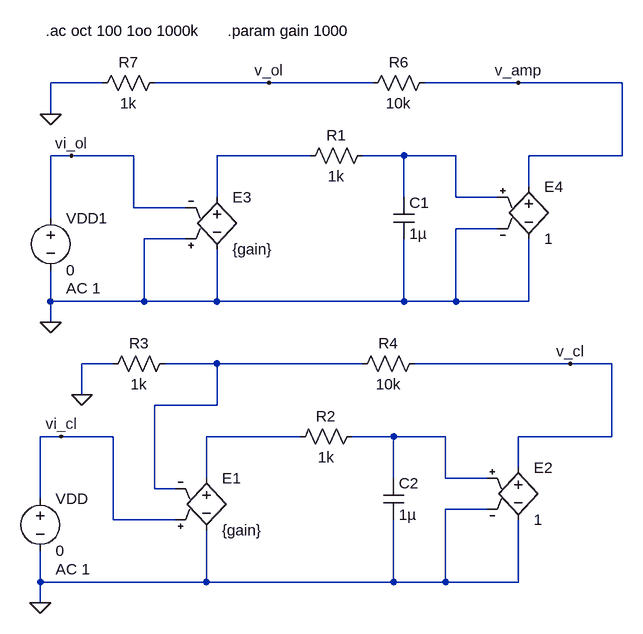
[diagram p0: schematic 1st_order.asc]
1st_order.asc, the LTspice schematic file:
Version 4
SHEET 1 1092 932
WIRE -928 -560 -1008 -560
WIRE -672 -560 -848 -560
WIRE -512 -560 -672 -560
WIRE -288 -560 -432 -560
WIRE -128 -560 -288 -560
WIRE -1008 -512 -1008 -560
WIRE -976 -448 -1008 -448
WIRE -880 -448 -976 -448
WIRE -608 -448 -752 -448
WIRE -464 -448 -528 -448
WIRE -384 -448 -464 -448
WIRE -128 -448 -128 -560
WIRE -128 -448 -272 -448
WIRE -272 -400 -272 -448
WIRE -752 -384 -752 -448
WIRE -464 -384 -464 -448
WIRE -384 -384 -384 -448
WIRE -320 -384 -384 -384
WIRE -880 -368 -880 -448
WIRE -800 -368 -880 -368
WIRE -1008 -352 -1008 -448
WIRE -320 -336 -384 -336
WIRE -800 -320 -864 -320
WIRE -1008 -224 -1008 -272
WIRE -864 -224 -864 -320
WIRE -864 -224 -1008 -224
WIRE -752 -224 -752 -304
WIRE -752 -224 -864 -224
WIRE -464 -224 -464 -320
WIRE -464 -224 -752 -224
WIRE -384 -224 -384 -336
WIRE -384 -224 -464 -224
WIRE -272 -224 -272 -320
WIRE -272 -224 -384 -224
WIRE -1008 -192 -1008 -224
WIRE -912 -128 -960 -128
WIRE -752 -128 -832 -128
WIRE -528 -128 -752 -128
WIRE -208 -128 -448 -128
WIRE -144 -128 -208 -128
WIRE -960 -80 -960 -128
WIRE -752 -64 -752 -128
WIRE -752 -64 -848 -64
WIRE -992 -16 -1024 -16
WIRE -912 -16 -992 -16
WIRE -624 -16 -768 -16
WIRE -480 -16 -544 -16
WIRE -400 -16 -480 -16
WIRE -144 -16 -144 -128
WIRE -144 -16 -288 -16
WIRE -288 32 -288 -16
WIRE -768 48 -768 -16
WIRE -480 48 -480 -16
WIRE -400 48 -400 -16
WIRE -336 48 -400 48
WIRE -848 64 -848 -64
WIRE -816 64 -848 64
WIRE -1024 80 -1024 -16
WIRE -336 96 -400 96
WIRE -912 112 -912 -16
WIRE -816 112 -912 112
WIRE -1024 208 -1024 160
WIRE -768 208 -768 128
WIRE -768 208 -1024 208
WIRE -480 208 -480 112
WIRE -480 208 -768 208
WIRE -400 208 -400 96
WIRE -400 208 -480 208
WIRE -288 208 -288 112
WIRE -288 208 -400 208
WIRE -1024 240 -1024 208
FLAG -1024 240 0
FLAG -992 -16 vi_cl
FLAG -1008 -192 0
FLAG -976 -448 vi_ol
FLAG -1008 -512 0
FLAG -672 -560 v_ol
FLAG -288 -560 v_amp
FLAG -208 -128 v_cl
FLAG -960 -80 0
SYMBOL voltage -1024 64 R0
WINDOW 123 24 124 Left 2
WINDOW 39 0 0 Left 2
SYMATTR Value2 AC 1
SYMATTR InstName VDD
SYMATTR Value 0
SYMBOL res -528 -32 R90
WINDOW 0 0 56 VBottom 2
WINDOW 3 32 56 VTop 2
SYMATTR InstName R2
SYMATTR Value 1k
SYMBOL cap -496 48 R0
SYMATTR InstName C2
SYMATTR Value 1µ
SYMBOL e2 -768 32 R0
SYMATTR InstName E1
SYMATTR Value {gain}
SYMBOL res -816 -144 R90
WINDOW 0 0 56 VBottom 2
WINDOW 3 32 56 VTop 2
SYMATTR InstName R3
SYMATTR Value 1k
SYMBOL res -432 -144 R90
WINDOW 0 0 56 VBottom 2
WINDOW 3 32 56 VTop 2
SYMATTR InstName R4
SYMATTR Value 10k
SYMBOL e -288 16 R0
SYMATTR InstName E2
SYMATTR Value 1
SYMBOL voltage -1008 -368 R0
WINDOW 123 24 124 Left 2
WINDOW 39 0 0 Left 2
SYMATTR Value2 AC 1
SYMATTR InstName VDD1
SYMATTR Value 0
SYMBOL res -512 -464 R90
WINDOW 0 0 56 VBottom 2
WINDOW 3 32 56 VTop 2
SYMATTR InstName R1
SYMATTR Value 1k
SYMBOL cap -480 -384 R0
SYMATTR InstName C1
SYMATTR Value 1µ
SYMBOL e2 -752 -400 R0
SYMATTR InstName E3
SYMATTR Value {gain}
SYMBOL e -272 -416 R0
SYMATTR InstName E4
SYMATTR Value 1
SYMBOL res -416 -576 R90
WINDOW 0 0 56 VBottom 2
WINDOW 3 32 56 VTop 2
SYMATTR InstName R6
SYMATTR Value 10k
SYMBOL res -832 -576 R90
WINDOW 0 0 56 VBottom 2
WINDOW 3 32 56 VTop 2
SYMATTR InstName R7
SYMATTR Value 1k
TEXT -1016 -640 Left 2 !.ac oct 100 1oo 1000k
TEXT -736 -640 Left 2 !.param gain 1000

The netlist it stands for:
* 1st_order.asc
VDD vi_cl 0 0 AC 1
R2 N005 N004 1k
C2 N005 0 1µ
E1 N004 0 vi_cl N003 {gain}
R3 N003 0 1k
R4 v_cl N003 10k
E2 v_cl 0 N005 0 1
VDD1 vi_ol 0 0 AC 1
R1 N002 N001 1k
C1 N002 0 1µ
E3 N001 0 0 vi_ol {gain}
E4 v_amp 0 N002 0 1
R6 v_amp v_ol 10k
R7 v_ol 0 1k
.ac oct 100 1oo 1000k
.param gain 1000
.backanno
.end